# EAGLE schematic 128x16 (EAGLE 7.4.0)

## Sheet 1 of 2
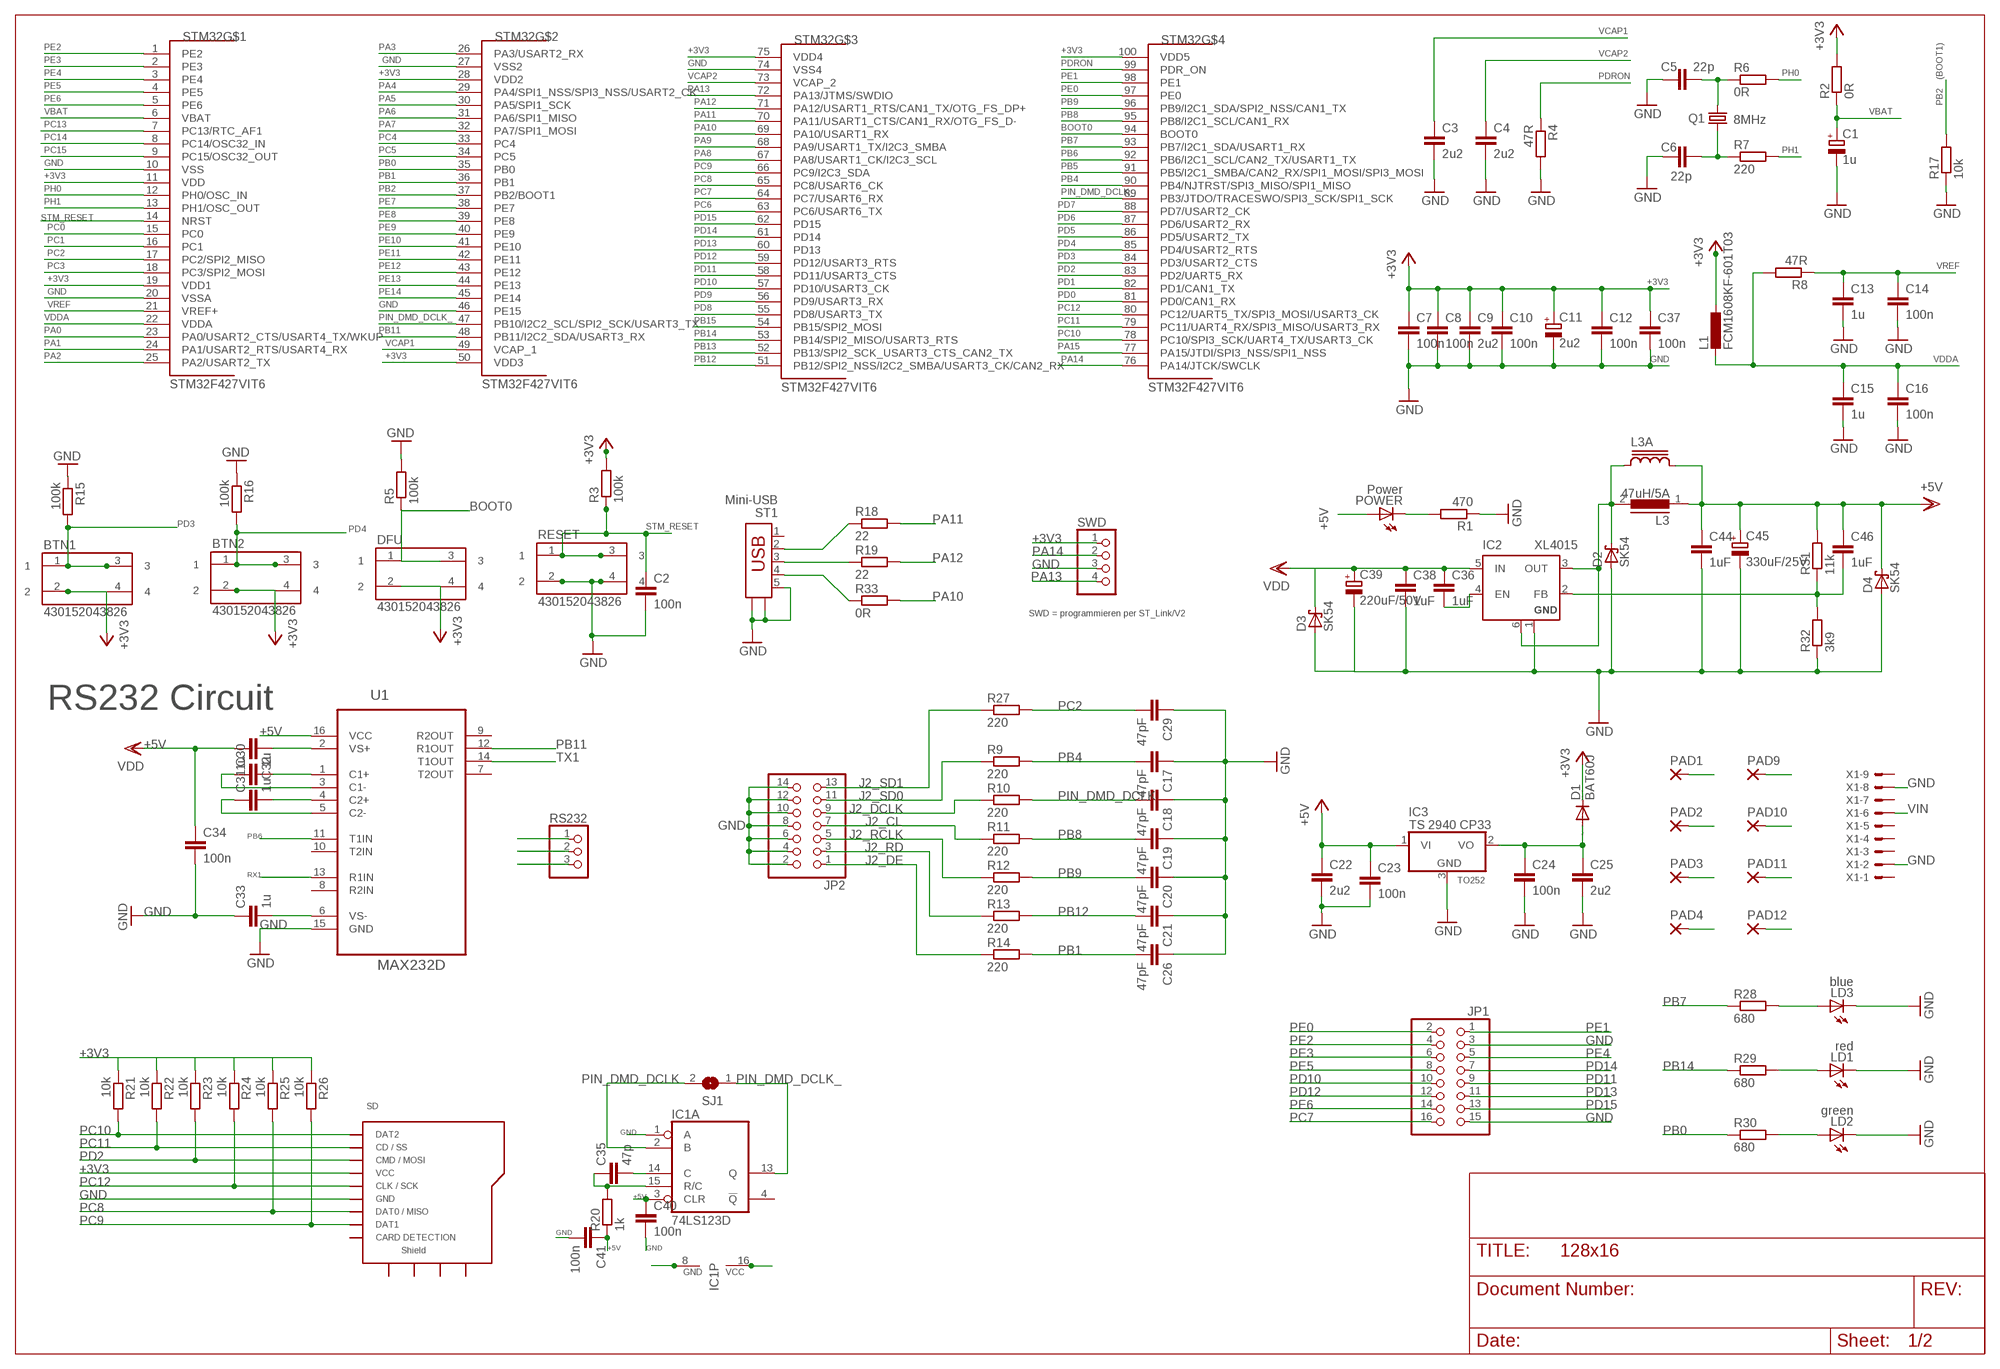
[diagram p0: schematic, sheet 1]

### Parts
BTN1  430152043826  [430152043826]
BTN2  430152043826  [430152043826]
C1  1u  CPOL-EUCT3528  [CT3528]
C2  100n  C-EUC0805K  [C0805K]
C3  2u2  C-EUC0805  [C0805]
C4  2u2  C-EUC0805  [C0805]
C5  22p  C-EUC0805K  [C0805K]
C6  22p  C-EUC0805K  [C0805K]
C7  100n  C-EUC0805K  [C0805K]
C8  100n  C-EUC0805K  [C0805K]
C9  2u2  C-EUC1206  [C1206]
C10  100n  C-EUC0805K  [C0805K]
C11  2u2  CPOL-EUCT3528  [CT3528]
C12  100n  C-EUC0805K  [C0805K]
C13  1u  C-EUC1206  [C1206]
C14  100n  C-EUC0805K  [C0805K]
C15  1u  C-EUC1206  [C1206]
C16  100n  C-EUC0805K  [C0805K]
C17  47pF  C-EUC0805K  [C0805K]
C18  47pF  C-EUC0805K  [C0805K]
C19  47pF  C-EUC0805  [C0805]
C20  47pF  C-EUC0805  [C0805]
C21  47pF  C-EUC0805  [C0805]
C22  2u2  C-EUC1206  [C1206]
C23  100n  C-EUC0805K  [C0805K]
C24  100n  C-EUC0805K  [C0805K]
C25  2u2  C-EUC1206  [C1206]
C26  47pF  C-EUC0805  [C0805]
C29  47pF  C-EUC0805K  [C0805K]
C30  1u  C-EUC0805  [C0805]
C31  1u  C-EUC0805  [C0805]
C32  1u  C-EUC0805  [C0805]
C33  1u  C-EUC0805  [C0805]
C34  100n  C-EUC0805  [C0805]
C35  47p  C-EUC0805K  [C0805K]
C36  1uF  C-EUC1206  [C1206]
C37  100n  C-EUC0805K  [C0805K]
C38  1uF  C-EUC1206  [C1206]
C39  220uF/50V  CPOL-EUG  [PANASONIC_G]
C40  100n  C-EUC0805K  [C0805K]
C41  100n  C-EUC0805K  [C0805K]
C44  1uF  C-EUC1206  [C1206]
C45  330uF/25V  CPOL-EUG  [PANASONIC_G]
C46  1uF  C-EUC1206  [C1206]
D1  BAT60J  DIODE-SOD323-W  [SOD323-W]
D2  SK54  SCHOTTKY-DIODESMD  [SMB]
D3  SK54  SCHOTTKY-DIODESMD  [SMB]
D4  SK54  SCHOTTKY-DIODESMD  [SMB]
DFU  430152043826  [430152043826]
IC1  74LS123D  [SO16]
IC2  XL4015  [TO263-5]
IC3  TS 2940 CP33  7808DT  [TO252]
JP1  PINHD-2X8  [2X08]
JP2  PINHD-2X7_2.54-SMD  [2X07SMD]
L1  FCM1608KF-601T03  L-EUL2012C  [L2012C]
L3  47uH/5A  ED16  [ED16]
L3A  SRR1206  [SRR1206]
LD1  red  LEDCHIP-LED0805  [CHIP-LED0805]
LD2  green  LEDCHIP-LED0805  [CHIP-LED0805]
LD3  blue  LEDCHIP-LED0805  [CHIP-LED0805]
PAD1  SMD5  [SMD2,54-5,08]
PAD2  SMD5  [SMD2,54-5,08]
PAD3  SMD5  [SMD2,54-5,08]
PAD4  SMD5  [SMD2,54-5,08]
PAD9  SMD5  [SMD2,54-5,08]
PAD10  SMD5  [SMD2,54-5,08]
PAD11  SMD5  [SMD2,54-5,08]
PAD12  SMD5  [SMD2,54-5,08]
POWER  Power  LEDCHIPLED_0805  [CHIPLED_0805]
Q1  8MHz  CRYSTALHC49UP  [HC49UP]
R1  470  R-EU_R0805  [R0805]
R2  0R  R-EU_R0805  [R0805]
R3  100k  R-EU_R0805  [R0805]
R4  47R  R-EU_R0805  [R0805]
R5  100k  R-EU_R0805  [R0805]
R6  0R  R-EU_R0805  [R0805]
R7  220  R-EU_R0805  [R0805]
R8  47R  R-EU_R0805  [R0805]
R9  220  R-EU_R0805  [R0805]
R10  220  R-EU_R0805  [R0805]
R11  220  R-EU_R0805  [R0805]
R12  220  R-EU_R0805  [R0805]
R13  220  R-EU_R0805  [R0805]
R14  220  R-EU_R0805  [R0805]
R15  100k  R-EU_R0805  [R0805]
R16  100k  R-EU_R0805  [R0805]
R17  10k  R-EU_R0805  [R0805]
R18  22  R-EU_R0805  [R0805]
R19  22  R-EU_R0805  [R0805]
R20  1k  R-EU_R0805  [R0805]
R21  10k  R-EU_R0805  [R0805]
R22  10k  R-EU_R0805  [R0805]
R23  10k  R-EU_R0805  [R0805]
R24  10k  R-EU_R0805  [R0805]
R25  10k  R-EU_R0805  [R0805]
R26  10k  R-EU_R0805  [R0805]
R27  220  R-EU_R0805  [R0805]
R28  680  R-EU_R0805  [R0805]
R29  680  R-EU_R0805  [R0805]
R30  680  R-EU_R0805  [R0805]
R31  11k  R-EU_R1206  [R1206]
R32  3k9  R-EU_R1206  [R1206]
R33  0R  R-EU_R0805  [R0805]
RESET  430152043826  [430152043826]
RS232  PINHD-1X3  [1X03]
SD  MICROSD_CARD_POLLIN  [MR**-AP*03**]
SJ1  SJ  [SJ]
ST1  Mini-USB  UBS-MINI  [USBMINI]
STM32  STM32F427VIT6  STM32F407VX  [LQFP100]
SWD  PINHD-1X4  [1X04]
U1  MAX232D  [SOIC127P600X175-16N]
X1  KK-156-9  [KK-156-9]

### Nets
+3V3: BTN1.2 BTN1.4 BTN2.2 BTN2.4 C7.1 C8.1 C9.1 C10.1 C11.+ C12.1 C37.1 D1.C DFU.2 DFU.4 L1.1 R2.2 R3.2 R21.1 R22.1 R23.1 R24.1 R25.1 R26.1 SD.VCC STM32.11(VDD) STM32.19(VDD1) STM32.28(VDD2) STM32.50(VDD3) STM32.75(VDD4) STM32.100(VDD5) SWD.1
+5V: C22.1 C23.1 C32.2 C34.1 C40.1 C41.1 C44.1 C45.+ C46.1 D4.C IC1.3(A:CLR) IC1.16(P:VCC) IC3.1(VI) L3.1 L3A.2 PAD1.1(P) PAD2.1(P) PAD9.1(P) PAD10.1(P) POWER.A R20.1 R31.2 U1.16(VCC) ; supply symbol labelled VDD ; also sheet 2
BOOT0: DFU.1 DFU.3 R5.1 STM32.94(BOOT0)
GND: C1.- C2.2 C3.2 C4.2 C5.2 C6.2 C7.2 C8.2 C9.2 C10.2 C11.- C12.2 C13.2 C14.2 C15.2 C16.2 C17.1 C18.1 C19.1 C20.1 C21.1 C22.2 C23.2 C24.2 C25.2 C26.1 C29.1 C33.1 C34.2 C37.2 C38.2 C39.- C40.2 C41.2 C44.2 C45.- D2.A D3.A D4.A IC1.1(A:A) IC1.8(P:GND) IC2.1(GND) IC3.3(GND) JP1.3 JP1.15 JP2.2 JP2.4 JP2.6 JP2.8 JP2.10 JP2.12 JP2.14 LD1.C LD2.C LD3.C PAD3.1(P) PAD4.1(P) PAD11.1(P) PAD12.1(P) R1.1 R4.2 R5.2 R15.1 R16.1 R17.1 R32.1 RESET.2 RESET.4 RS232.2 SD.GND ST1.5 ST1.N1 ST1.N2 STM32.10(VSS) STM32.20(VSSA) STM32.27(VSS2) STM32.46(PE15) STM32.74(VSS4) SWD.3 U1.15(GND) X1.2 X1.8 ; also sheet 2
J2_CL: JP2.7 R11.1 ; also sheet 2
J2_DCLK: JP2.9 R10.1 ; also sheet 2
J2_DE: JP2.1 R14.1 ; also sheet 2
J2_RCLK: JP2.5 R12.1 ; also sheet 2
J2_RD: JP2.3 R13.1 ; also sheet 2
J2_SD0: JP2.11 R9.1 ; also sheet 2
J2_SD1: JP2.13 R27.1 ; also sheet 2
N$1: C5.1 Q1.2 R6.1
N$2: C6.1 Q1.1 R7.1
N$3: POWER.C R1.2
N$10: C35.1 IC1.15(A:R/C) R20.2
N$12: C24.1 C25.1 D1.A IC3.2(VO)
N$13: C30.2 U1.1(C1+)
N$14: C30.1 U1.3(C1-)
N$15: C31.2 U1.4(C2+)
N$16: C31.1 U1.5(C2-)
N$17: C33.2 U1.6(VS-)
N$18: C32.1 U1.2(VS+)
N$19: LD1.A R29.2
N$20: D2.C IC2.3(OUT) IC2.6(TAB) L3.2 L3A.1
N$21: C46.2 IC2.2(FB) R31.1 R32.2
N$22: C35.2 IC1.14(A:C)
N$23: LD3.A R28.2
N$24: C36.2 IC2.4(EN)
N$25: R33.1 ST1.4
N$26: LD2.A R30.2
N$39: R19.1 ST1.3
N$40: R18.1 ST1.2
PA0: STM32.23(PA0/USART2_CTS/USART4_TX/WKUP)
PA1: STM32.24(PA1/USART2_RTS/USART4_RX)
PA2: STM32.25(PA2/USART2_TX)
PA3: STM32.26(PA3/USART2_RX)
PA4: STM32.29(PA4/SPI1_NSS/SPI3_NSS/USART2_CK)
PA5: STM32.30(PA5/SPI1_SCK)
PA6: STM32.31(PA6/SPI1_MISO)
PA7: STM32.32(PA7/SPI1_MOSI)
PA8: STM32.67(PA8/USART1_CK/I2C3_SCL)
PA9: STM32.68(PA9/USART1_TX/I2C3_SMBA)
PA10: R33.2 STM32.69(PA10/USART1_RX)
PA11: R18.2 STM32.70(PA11/USART1_CTS/CAN1_RX/OTG_FS_D-)
PA12: R19.2 STM32.71(PA12/USART1_RTS/CAN1_TX/OTG_FS_DP+)
PA13: STM32.72(PA13/JTMS/SWDIO) SWD.4
PA14: STM32.76(PA14/JTCK/SWCLK) SWD.2
PA15: STM32.77(PA15/JTDI/SPI3_NSS/SPI1_NSS)
PB0: R30.1 STM32.35(PB0)
PB1: C26.2 R14.2 STM32.36(PB1)
PB2: R17.2 STM32.37(PB2/BOOT1)
PB4: C17.2 R9.2 STM32.90(PB4/NJTRST/SPI3_MISO/SPI1_MISO)
PB5: STM32.91(PB5/I2C1_SMBA/CAN2_RX/SPI1_MOSI/SPI3_MOSI)
PB6: STM32.92(PB6/I2C1_SCL/CAN2_TX/USART1_TX) U1.11(T1IN)
PB7: R28.1 STM32.93(PB7/I2C1_SDA/USART1_RX)
PB8: C19.2 R11.2 STM32.95(PB8/I2C1_SCL/CAN1_RX)
PB9: C20.2 R12.2 STM32.96(PB9/I2C1_SDA/SPI2_NSS/CAN1_TX)
PB11: STM32.48(PB11/I2C2_SDA/USART3_RX) U1.12(R1OUT)
PB12: C21.2 R13.2 STM32.51(PB12/SPI2_NSS/I2C2_SMBA/USART3_CK/CAN2_RX)
PB13: STM32.52(PB13/SPI2_SCK_USART3_CTS_CAN2_TX)
PB14: R29.1 STM32.53(PB14/SPI2_MISO/USART3_RTS)
PB15: STM32.54(PB15/SPI2_MOSI)
PC0: STM32.15(PC0)
PC1: STM32.16(PC1)
PC2: C29.2 R27.2 STM32.17(PC2/SPI2_MISO)
PC3: STM32.18(PC3/SPI2_MOSI)
PC4: STM32.33(PC4)
PC5: STM32.34(PC5)
PC6: STM32.63(PC6/USART6_TX)
PC7: JP1.16 STM32.64(PC7/USART6_RX)
PC8: R25.2 SD.DAT0(DAT0/MISO) STM32.65(PC8/USART6_CK)
PC9: R26.2 SD.DAT1 STM32.66(PC9/I2C3_SDA)
PC10: R21.2 SD.DAT2 STM32.78(PC10/SPI3_SCK/UART4_TX/USART3_CK)
PC11: R22.2 SD.DAT3/CS(CD/SS) STM32.79(PC11/UART4_RX/SPI3_MISO/USART3_RX)
PC12: R24.2 SD.CLK(CLK/SCK) STM32.80(PC12/UART5_TX/SPI3_MOSI/USART3_CK)
PC13: STM32.7(PC13/RTC_AF1)
PC14: STM32.8(PC14/OSC32_IN)
PC15: STM32.9(PC15/OSC32_OUT)
PD0: STM32.81(PD0/CAN1_RX)
PD1: STM32.82(PD1/CAN1_TX)
PD2: R23.2 SD.CMD(CMD/MOSI) STM32.83(PD2/UART5_RX)
PD3: BTN1.1 BTN1.3 R15.2 STM32.84(PD3/USART2_CTS)
PD4: BTN2.1 BTN2.3 R16.2 STM32.85(PD4/USART2_RTS)
PD5: STM32.86(PD5/USART2_TX)
PD6: STM32.87(PD6/USART2_RX)
PD7: STM32.88(PD7/USART2_CK)
PD8: STM32.55(PD8/USART3_TX)
PD9: STM32.56(PD9/USART3_RX)
PD10: JP1.10 STM32.57(PD10/USART3_CK)
PD11: JP1.9 STM32.58(PD11/USART3_CTS)
PD12: JP1.12 STM32.59(PD12/USART3_RTS)
PD13: JP1.11 STM32.60(PD13)
PD14: JP1.7 STM32.61(PD14)
PD15: JP1.13 STM32.62(PD15)
PDRON: R4.1 STM32.99(PDR_ON)
PE0: JP1.2 STM32.97(PE0)
PE1: JP1.1 STM32.98(PE1)
PE2: JP1.4 STM32.1(PE2)
PE3: JP1.6 STM32.2(PE3)
PE4: JP1.5 STM32.3(PE4)
PE5: JP1.8 STM32.4(PE5)
PE6: JP1.14 STM32.5(PE6)
PE7: STM32.38(PE7)
PE8: STM32.39(PE8)
PE9: STM32.40(PE9)
PE10: STM32.41(PE10)
PE11: STM32.42(PE11)
PE12: STM32.43(PE12)
PE13: STM32.44(PE13)
PE14: STM32.45(PE14)
PH0: R6.2 STM32.12(PH0/OSC_IN)
PH1: R7.2 STM32.13(PH1/OSC_OUT)
PIN_DMD_DCLK: C18.2 IC1.2(A:B) R10.2 SJ1.2
PIN_DMD_DCLK_: IC1.13(A:Q) SJ1.1 STM32.47(PB10/I2C2_SCL/SPI2_SCK/USART3_TX) STM32.89(PB3/JTDO/TRACESWO/SPI3_SCK/SPI1_SCK)
RX1: RS232.3 U1.13(R1IN)
STM_RESET: C2.1 R3.1 RESET.1 RESET.3 STM32.14(NRST)
TX1: RS232.1 U1.14(T1OUT)
VBAT: C1.+ R2.1 STM32.6(VBAT)
VCAP1: C3.1 STM32.49(VCAP_1)
VCAP2: C4.1 STM32.73(VCAP_2)
VDDA: C15.1 C16.1 L1.2 R8.2 STM32.22(VDDA)
VIN: C36.1 C38.1 C39.+ D3.C IC2.5(IN) X1.6 ; supply symbol labelled VDD
VREF: C13.1 C14.1 R8.1 STM32.21(VREF+)
Unconnected: IC1.4(A:!Q) IC1.5(B:Q) IC1.6(B:C) IC1.7(B:R/C) IC1.9(B:A) IC1.10(B:B) IC1.11(B:CLR) IC1.12(B:!Q) SD.CARD_DETECTION(CARD_D) SD.SHD_1(SHD1) SD.SHD_2(SHD2) SD.SHD_3(SHD3) SD.SHD_4(SHD4) ST1.1 U1.7(T2OUT) U1.8(R2IN) U1.9(R2OUT) U1.10(T2IN) X1.1 X1.3 X1.4 X1.5 X1.7 X1.9

### Notes on the sheet
- (BOOT1)
- SWD = programmieren per ST_Link/V2
- RS232 Circuit
- TO252

## Sheet 2 of 2
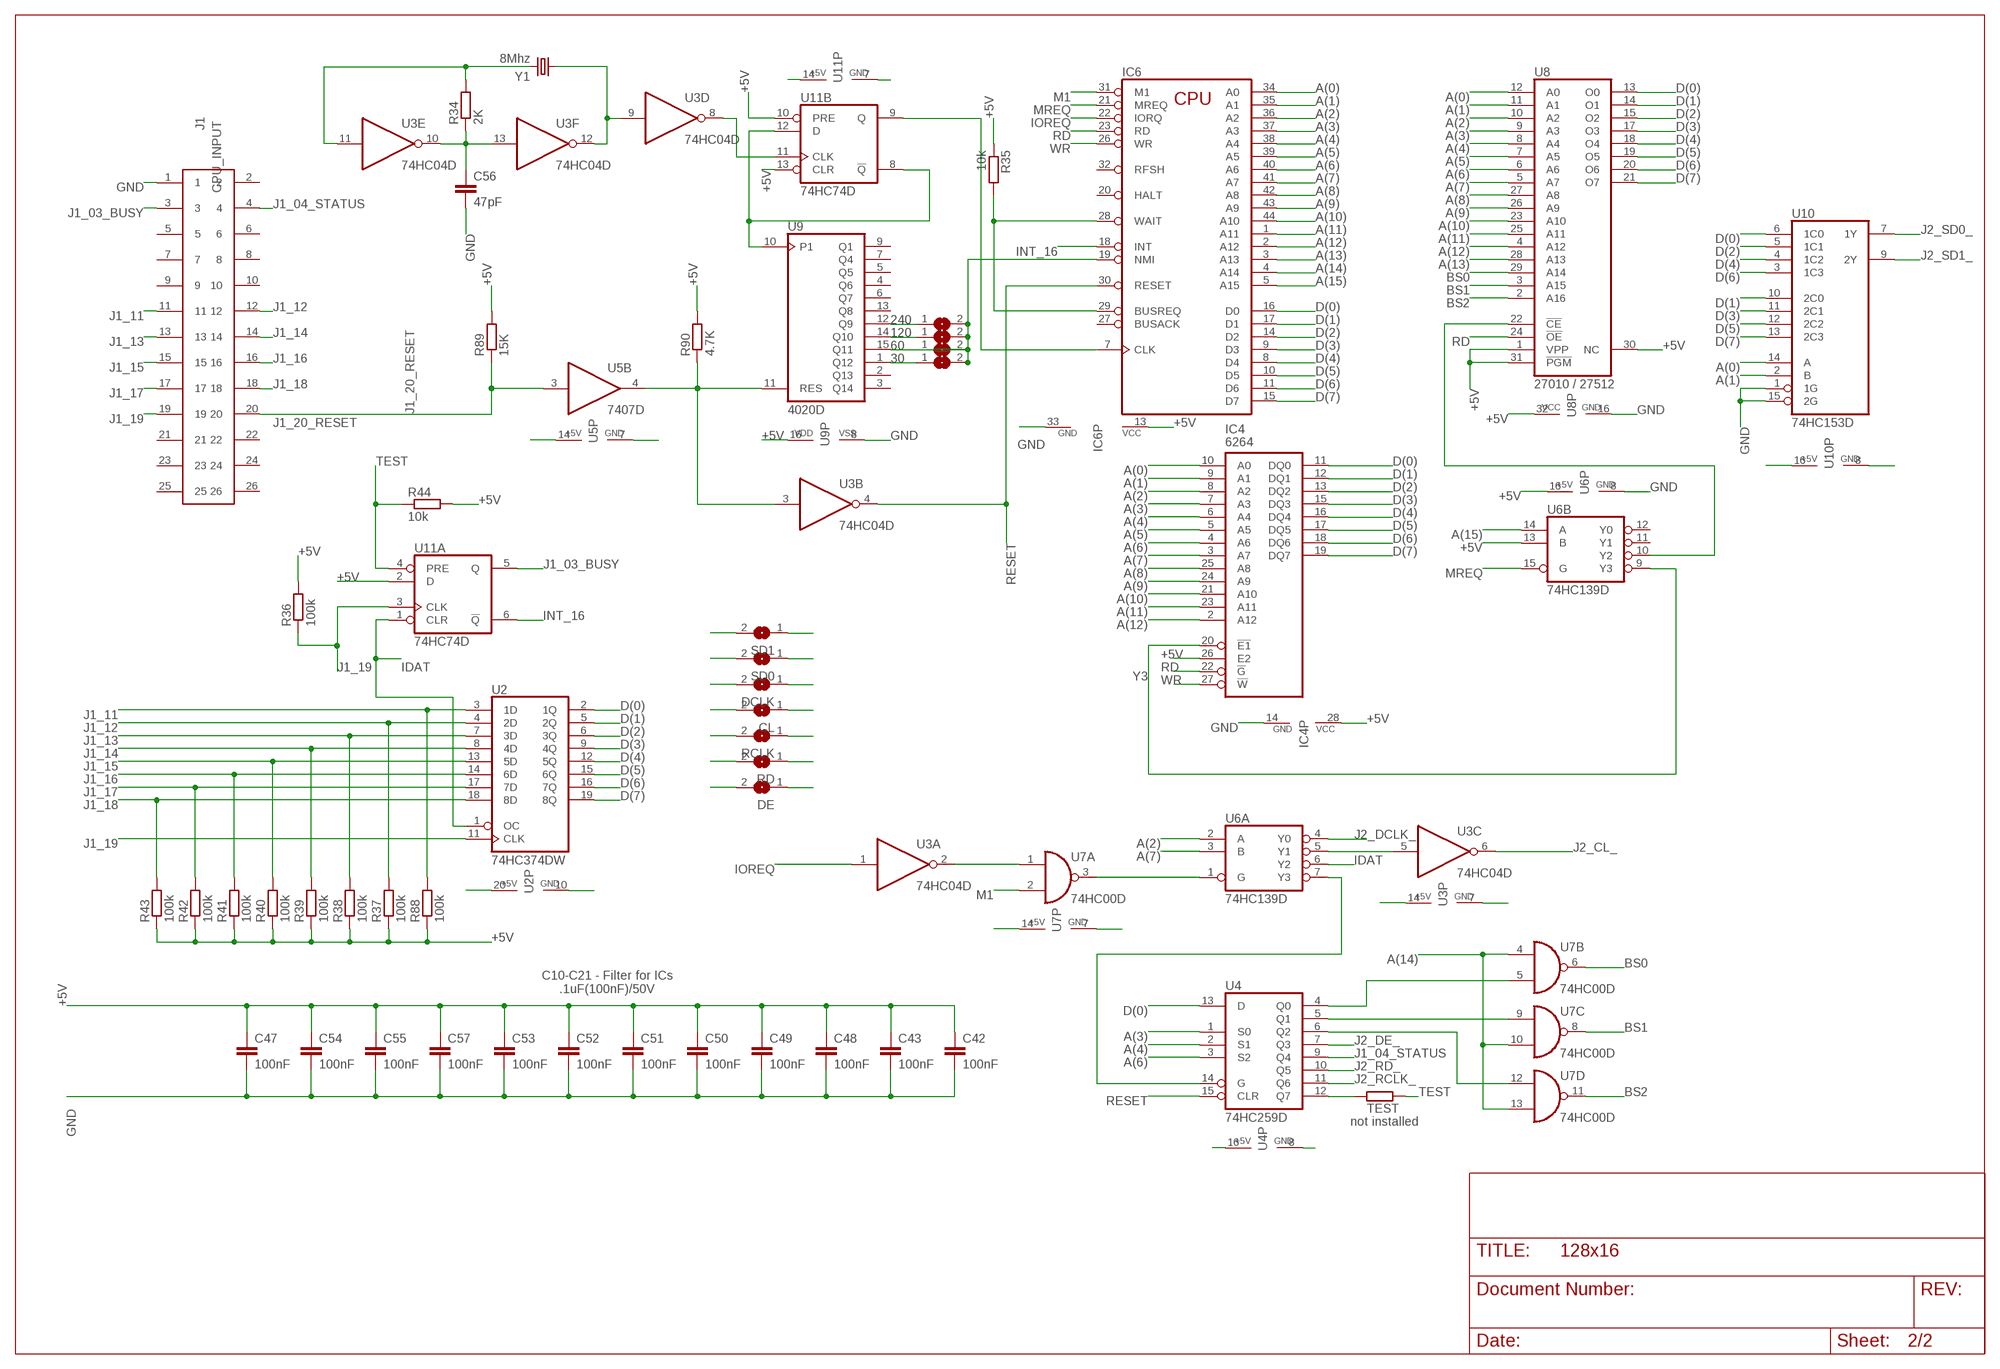
[diagram p1: schematic, sheet 2]

### Parts
30  SJ  [SJ]
60  SJ  [SJ]
120  SJ  [SJ]
240  SJ  [SJ]
C42  100nF  C-EUC0805K  [C0805K]
C43  100nF  C-EUC0805K  [C0805K]
C47  100nF  C-EUC0805K  [C0805K]
C48  100nF  C-EUC0805K  [C0805K]
C49  100nF  C-EUC0805K  [C0805K]
C50  100nF  C-EUC0805K  [C0805K]
C51  100nF  C-EUC0805K  [C0805K]
C52  100nF  C-EUC0805K  [C0805K]
C53  100nF  C-EUC0805K  [C0805K]
C54  100nF  C-EUC0805K  [C0805K]
C55  100nF  C-EUC0805K  [C0805K]
C56  47pF  C-EUC0805K  [C0805K]
C57  100nF  C-EUC0805K  [C0805K]
CL  SJ  [SJ]
CPU_INPUT  J1  61202622323  [61202622323]
DCLK  SJ  [SJ]
DE  SJ  [SJ]
IC4  6264  [SO28W]
IC6  Z80CPU-V  [PLCC-44]
R34  2K  R-EU_R0805  [R0805]
R35  10k  R-EU_R0805  [R0805]
R36  100k  R-EU_R0805  [R0805]
R37  100k  R-EU_R0805  [R0805]
R38  100k  R-EU_R0805  [R0805]
R39  100k  R-EU_R0805  [R0805]
R40  100k  R-EU_R0805  [R0805]
R41  100k  R-EU_R0805  [R0805]
R42  100k  R-EU_R0805  [R0805]
R43  100k  R-EU_R0805  [R0805]
R44  10k  R-EU_R0805  [R0805]
R88  100k  R-EU_R0805  [R0805]
R89  15K  R-EU_R0805  [R0805]
R90  4.7K  R-EU_R0805  [R0805]
RCLK  SJ  [SJ]
RD  SJ  [SJ]
SD0  SJ  [SJ]
SD1  SJ  [SJ]
TEST  R-EU_R0805  [R0805]
U2  74HC374DW  [SO20W]
U3  74HC04D  [SO14]
U4  74HC259D  [SO16]
U5  7407D  [SO14]
U6  74HC139D  [SO16]
U7  74HC00D  [SO14]
U8  27010 / 27512  27010  [DIL32]
U9  4020D  [SO16]
U10  74HC153D  [SO16]
U11  74HC74D  [SO14]
Y1  8Mhz  CRYSTALHC49UP  [HC49UP]

### Nets
30: 30.1 U9.1(Q12)
60: 30.2 60.1 60.2 120.2 240.2 IC6.19(NMI) U9.15(Q11)
120: 120.1 U9.14(Q10)
240: 240.1 U9.12(Q9)
+5V: C42.1 C43.1 C47.1 C48.1 C49.1 C50.1 C51.1 C52.1 C53.1 C54.1 C55.1 C57.1 IC4.26(E2) IC4.28(VCC) IC6.13(VCC) R35.1 R36.2 R37.1 R38.1 R39.1 R40.1 R41.1 R42.1 R43.1 R44.2 R88.1 R89.2 R90.2 U2.20(VCC) U3.14(P:VCC) U4.16(VCC) U5.14(P:VCC) U6.13(B:B) U6.16(P:VCC) U7.14(P:VCC) U8.1(VPP) U8.30(NC) U8.31(!PGM) U8.32(VCC) U9.16(VDD) U10.16(VCC) U11.2(A:D) U11.10(B:PRE) U11.13(B:CLR) U11.14(P:VCC) ; also sheet 1
A(0): IC4.10(A0) IC6.34(A0) U8.12(A0) U10.14(A)
A(1): IC4.9(A1) IC6.35(A1) U8.11(A1) U10.2(B)
A(2): IC4.8(A2) IC6.36(A2) U6.2(A:A) U8.10(A2)
A(3): IC4.7(A3) IC6.37(A3) U4.1(S0) U8.9(A3)
A(4): IC4.6(A4) IC6.38(A4) U4.2(S1) U8.8(A4)
A(5): IC4.5(A5) IC6.39(A5) U8.7(A5)
A(6): IC4.4(A6) IC6.40(A6) U4.3(S2) U8.6(A6)
A(7): IC4.3(A7) IC6.41(A7) U6.3(A:B) U8.5(A7)
A(8): IC4.25(A8) IC6.42(A8) U8.27(A8)
A(9): IC4.24(A9) IC6.43(A9) U8.26(A9)
A(10): IC4.21(A10) IC6.44(A10) U8.23(A10)
A(11): IC4.23(A11) IC6.1(A11) U8.25(A11)
A(12): IC4.2(A12) IC6.2(A12) U8.4(A12)
A(13): IC6.3(A13) U8.28(A13)
A(14): IC6.4(A14) U7.4(B:I0) U7.10(C:I1) U7.13(D:I1)
A(15): IC6.5(A15) U6.14(B:A)
BS0: U7.6(B:O) U8.29(A14)
BS1: U7.8(C:O) U8.3(A15)
BS2: U7.11(D:O) U8.2(A16)
D(0): IC4.11(DQ0) IC6.16(D0) U2.2(1Q) U4.13(D) U8.13(O0) U10.6(1C0)
D(1): IC4.12(DQ1) IC6.17(D1) U2.5(2Q) U8.14(O1) U10.10(2C0)
D(2): IC4.13(DQ2) IC6.14(D2) U2.6(3Q) U8.15(O2) U10.5(1C1)
D(3): IC4.15(DQ3) IC6.9(D3) U2.9(4Q) U8.17(O3) U10.11(2C1)
D(4): IC4.16(DQ4) IC6.8(D4) U2.12(5Q) U8.18(O4) U10.4(1C2)
D(5): IC4.17(DQ5) IC6.10(D5) U2.15(6Q) U8.19(O5) U10.12(2C2)
D(6): IC4.18(DQ6) IC6.11(D6) U2.16(7Q) U8.20(O6) U10.3(1C3)
D(7): IC4.19(DQ7) IC6.15(D7) U2.19(8Q) U8.21(O7) U10.13(2C3)
GND: C42.2 C43.2 C47.2 C48.2 C49.2 C50.2 C51.2 C52.2 C53.2 C54.2 C55.2 C56.2 C57.2 CPU_INPUT.1 IC4.14(GND) IC6.33(GND) U2.10(GND) U3.7(P:GND) U4.8(GND) U5.7(P:GND) U6.8(P:GND) U7.7(P:GND) U8.16(GND) U9.8(VSS) U10.1(1G) U10.8(GND) U10.15(2G) U11.7(P:GND) ; also sheet 1
IDAT: U2.1(OC) U6.6(A:Y2) U11.1(A:CLR)
INT_16: IC6.18(INT) U11.6(A:!Q)
IOREQ: IC6.22(IORQ) U3.1(A:I)
J1_03_BUSY: CPU_INPUT.3 U11.5(A:Q)
J1_04_STATUS: CPU_INPUT.4 U4.9(Q4)
J1_11: CPU_INPUT.11 R88.2 U2.3(1D)
J1_12: CPU_INPUT.12 R37.2 U2.4(2D)
J1_13: CPU_INPUT.13 R38.2 U2.7(3D)
J1_14: CPU_INPUT.14 R39.2 U2.8(4D)
J1_15: CPU_INPUT.15 R40.2 U2.13(5D)
J1_16: CPU_INPUT.16 R41.2 U2.14(6D)
J1_17: CPU_INPUT.17 R42.2 U2.17(7D)
J1_18: CPU_INPUT.18 R43.2 U2.18(8D)
J1_19: CPU_INPUT.19 R36.1 U2.11(CLK) U11.3(A:CLK)
J1_20_RESET: CPU_INPUT.20 R89.1 U5.3(B:I)
J2_CL: CL.1 ; also sheet 1
J2_CL_: CL.2 U3.6(C:O)
J2_DCLK: DCLK.1 ; also sheet 1
J2_DCLK_: DCLK.2 U6.4(A:Y0)
J2_DE: DE.1 ; also sheet 1
J2_DE_: DE.2 U4.7(Q3)
J2_RCLK: RCLK.1 ; also sheet 1
J2_RCLK_: RCLK.2 U4.11(Q6)
J2_RD: RD.1 ; also sheet 1
J2_RD_: RD.2 U4.10(Q5)
J2_SD0: SD0.1 ; also sheet 1
J2_SD0_: SD0.2 U10.7(1Y)
J2_SD1: SD1.1 ; also sheet 1
J2_SD1_: SD1.2 U10.9(2Y)
M1: IC6.31(M1) U7.2(A:I1)
MREQ: IC6.21(MREQ) U6.15(B:G)
N$27: C56.1 R34.1 U3.10(E:O) U3.13(F:I)
N$41: R34.2 U3.11(E:I) Y1.2
N$42: U3.9(D:I) U3.12(F:O) Y1.1
N$43: U3.8(D:O) U11.11(B:CLK)
N$44: U9.10(P1) U11.8(B:!Q) U11.12(B:D)
N$45: R90.1 U3.3(B:I) U5.4(B:O) U9.11(RES)
N$46: IC6.7(CLK) U11.9(B:Q)
N$47: IC6.28(WAIT) IC6.29(BUSREQ) R35.2
N$48: U6.1(A:G) U7.3(A:O)
N$49: U3.5(C:I) U6.5(A:Y1)
N$50: U3.2(A:O) U7.1(A:I0)
N$51: U4.14(G) U6.7(A:Y3)
N$52: U6.10(B:Y2) U8.22(!CE)
N$53: U4.4(Q0) U7.5(B:I1)
N$54: U4.5(Q1) U7.9(C:I0)
N$55: U4.6(Q2) U7.12(D:I0)
N$56: TEST.2 U4.12(Q7)
RD: IC4.22(!G) IC6.23(RD) U8.24(!OE)
RESET: IC6.30(RESET) U3.4(B:O) U4.15(CLR)
TEST: R44.1 TEST.1 U11.4(A:PRE)
WR: IC4.27(!W) IC6.26(WR)
Y3: IC4.20(!E1) U6.9(B:Y3)
Unconnected: CPU_INPUT.2 CPU_INPUT.5 CPU_INPUT.6 CPU_INPUT.7 CPU_INPUT.8 CPU_INPUT.9 CPU_INPUT.10 CPU_INPUT.21 CPU_INPUT.22 CPU_INPUT.23 CPU_INPUT.24 CPU_INPUT.25 CPU_INPUT.26 IC4.1(NC) IC6.6(NC) IC6.12(NC) IC6.20(HALT) IC6.24(NC) IC6.25(NC) IC6.27(BUSACK) IC6.32(RFSH) U5.1(A:I) U5.2(A:O) U5.5(C:I) U5.6(C:O) U5.8(D:O) U5.9(D:I) U5.10(E:O) U5.11(E:I) U5.12(F:O) U5.13(F:I) U6.11(B:Y1) U6.12(B:Y0) U9.2(Q13) U9.3(Q14) U9.4(Q6) U9.5(Q5) U9.6(Q7) U9.7(Q4) U9.9(Q1) U9.13(Q8)

### Notes on the sheet
- C10-C21 - Filter for ICs
  .1uF(100nF)/50V
- not installed

## Library data of the parts
30 60 120 240 CL DCLK DE RCLK RD SD0 SD1 SJ1 = jumper:SJ: SMD solder JUMPER
BTN1 BTN2 DFU RESET = Switches_rev16a:430152043826: WS-TSS-6x6 mm SMD Tact Switch,4 pins
C1 C11 = rcl:CPOL-EU: POLARIZED CAPACITOR, European symbol
C2 C5-C8 C10 C12 C16 C23 C24 C37 = rcl:C-EU: CAPACITOR, European symbol
C3 C4 C9 C13-C15 C17-C22 C25 C26 C29-C36 C38 C40-C44 C46-C57 = resistor:C-EU: CAPACITOR, European symbol
C39 C45 = resistor:CPOL-EU: POLARIZED CAPACITOR, European symbol
CPU_INPUT = Wuerth_Elektronik_eiCan_05_Box_Header_IDC_Connectors_1_2:61202622323: WR-BHD 2.54mm Board to Cable Transition Connector, 26 Pins
D1 = diode:DIODE-: DIODE
D2-D4 = diode:SCHOTTKY-DIODE: Schottky Diode
IC1 = 74xx-eu:74*123: Retriggerable monostable MULTIVIBRATOR
IC2 = linear4:XL4015
IC3 = linear:78*: Positive VOLTAGE REGULATOR Source: http://cache.national.com/ds/LM/LM78L05.pdf http://www.fairchildsemi.com/ds/LM/LM7805.pdf
IC4 = memories:6264: SRAM 8K x 8 bits
IC6 = Z80FAMIL:Z80CPU-V
JP1 = pinhead:PINHD-2X8: PIN HEADER
JP2 = pinhead_smd:PINHD-2X7: PIN HEADER
L1 = rcl:L-EU: INDUCTOR, European symbol
L3 = inductors:ED16: INDUCTOR
L3A = inductor-bourns:SRR1206: POWER INDUCTOR
LD1-LD3 = adafruit:LED: LED
PAD1-PAD4 PAD9-PAD12 = wirepad:SMD5: SMD PAD
POWER = led:LED: LED
Q1 Y1 = crystal:CRYSTAL: CRYSTAL; OC_FARNELL: unknown; OC_NEWARK: unknown
R1 R2 R4 R6-R8 R17 R20 = rcl:R-EU_: RESISTOR, European symbol
R3 R5 R9-R16 R18 R19 R21-R44 R88-R90 TEST = resistor:R-EU_: RESISTOR, European symbol
RS232 = pinhead:PINHD-1X3: PIN HEADER
SD = 000_eigene_Bauteile:MICROSD_CARD_POLLIN
ST1 = con-amp:UBS-MINI
STM32 = STM32F407Vx_LQFP100:STM32F407VX: STmicroelectronics Cortex M4 Series Typ: STM32F407Vx LQFP100 Copyright 2012 by Ersan Günes, Quantitec, info@quantitec.de
SWD = pinhead:PINHD-1X4: PIN HEADER
U1 = MAX232D:MAX232D: DUAL EIA-232 DRIVERS/RECEIVERS
U2 = 74xx-eu:74*374: Octal D type transparent LATCH, edge triggered
U3 = 74xx-eu:74*04: Hex INVERTER
U4 = 74xx-eu:74*259: 8-bit addressable LATCH
U5 = 74xx-eu:74*07: Hex BUFFER, open collector high-voltage output
U6 = 74xx-eu:74*139: Dual 2-line to 4-line DECODER/DEMULTIPLEXER
U7 = 74xx-eu:74*00: Quad 2-input NAND gate
U8 = memory:27010: MEMORY
U9 = 40xx:4020: 14-stage binary/ripple COUNTER
U10 = 74xx-eu:74*153: Dual 4-line to 1-line data SELECTOR/MULTIPLEXER
U11 = 74xx-eu:74*74: Dual D type positive edge triggered FLIP FLOP, preset and clear
X1 = con-molex:KK-156-9: KK 156 HEADER Source: http://www.molex.com/pdm_docs/sd/026604100_sd.pdf; OC_FARNELL: unknown; OC_NEWARK: unknown